# EAGLE design LightController (EAGLE 6.5.0)
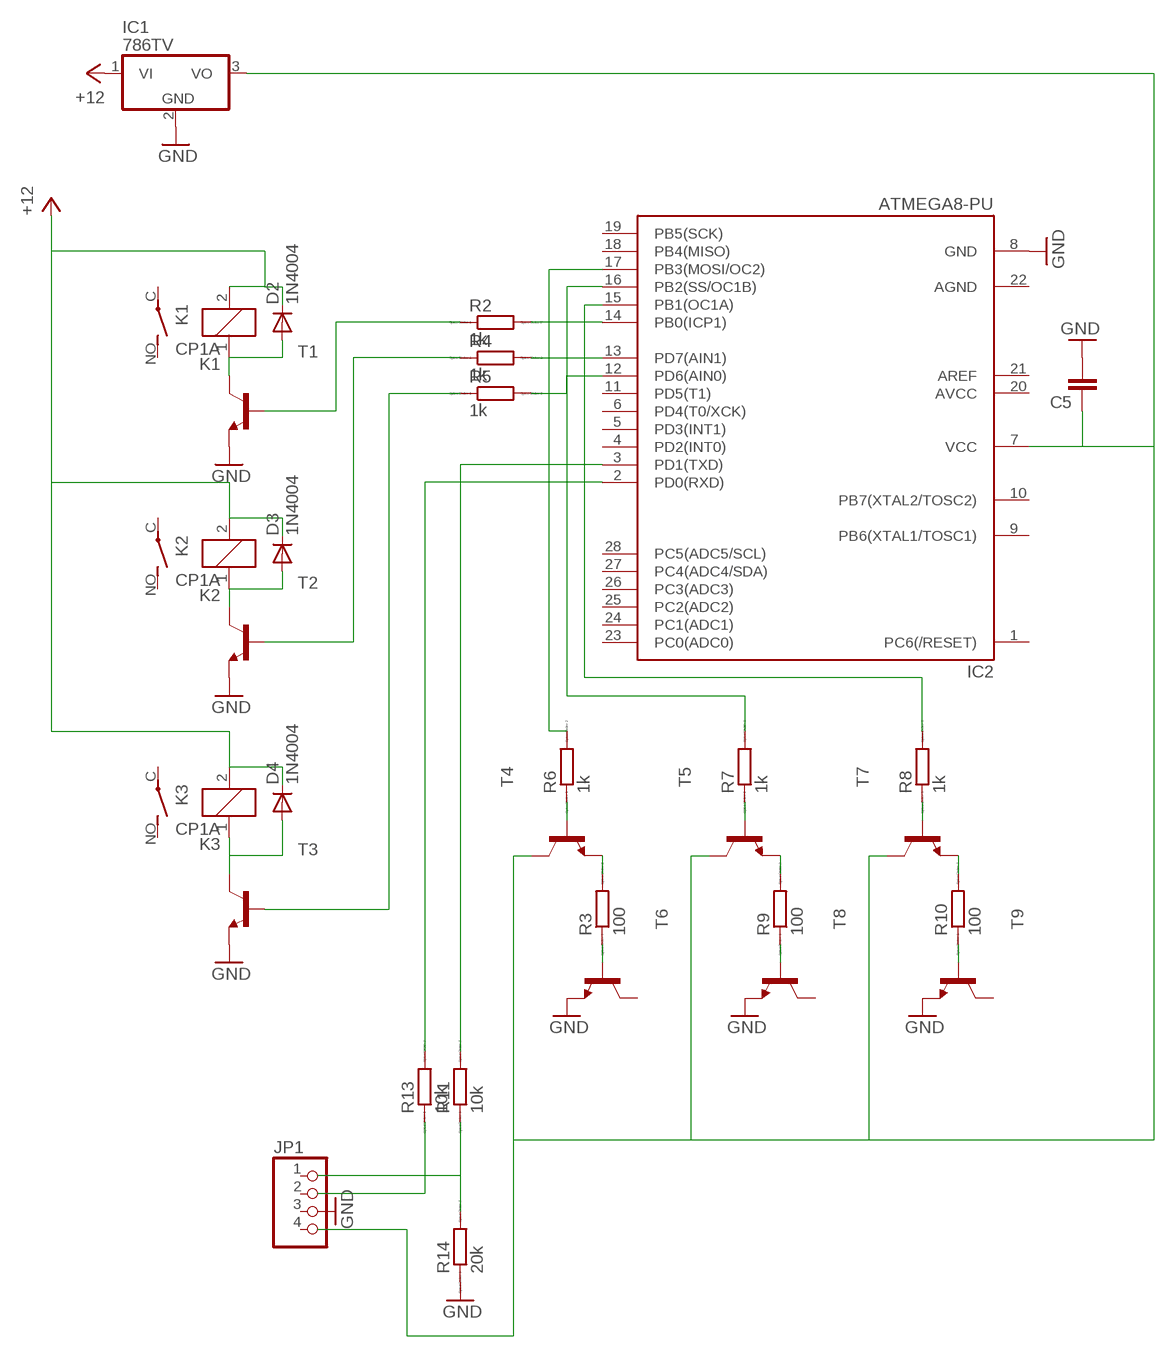
[diagram p0: schematic, sheet 1]

## Parts
C5  C2,5-3  [C2.5-3]
D2  1N4004  [DO41-10]
D3  1N4004  [DO41-10]
D4  1N4004  [DO41-10]
IC1  786TV  [TO220V]
IC2  ATMEGA8-PU  [DIL28-3]
JP1  PINHD-1X4  [1X04]
K1  CP1A  [CP1A]
K2  CP1A  [CP1A]
K3  CP1A  [CP1A]
R2  1k  R0204/7  [0204/7]
R3  100  R0204/7  [0204/7]
R4  1k  R0204/7  [0204/7]
R5  1k  R0204/7  [0204/7]
R6  1k  R0204/7  [0204/7]
R7  1k  R0204/7  [0204/7]
R8  1k  R0204/7  [0204/7]
R9  100  R0204/7  [0204/7]
R10  100  R0204/7  [0204/7]
R11  10k  R0204/7  [0204/7]
R13  10k  R0204/7  [0204/7]
R14  20k  R0204/7  [0204/7]
T1  -NPN-TO92-EBC  [TO92-EBC]
T2  -NPN-TO92-EBC  [TO92-EBC]
T3  -NPN-TO92-EBC  [TO92-EBC]
T4  -NPN-TO92-EBC  [TO92-EBC]
T5  -NPN-TO92-EBC  [TO92-EBC]
T6  BF420-NPN-TO92-BCE  [TO92-BCE]
T7  -NPN-TO92-EBC  [TO92-EBC]
T8  BF420-NPN-TO92-BCE  [TO92-BCE]
T9  BF420-NPN-TO92-BCE  [TO92-BCE]

## Nets
GND: C5.2 IC1.2(GND) IC2.8(GND) R14.1 T1.E T2.E T3.E T6.E T8.E T9.E
N$1: IC2.15(PB1(OC1A)) R8.2
N$2: IC2.16(PB2(SS/OC1B)) R7.2
N$3: R3.2 T4.E
N$4: D2.A K1.1 T1.C
N$5: IC2.14(PB0(ICP1)) R2.2
N$6: R2.1 T1.B
N$7: R4.1 T2.B
N$8: D4.A K3.1 T3.C
N$9: D3.A K2.1 T2.C
N$10: IC2.13(PD7(AIN1)) R4.2
N$11: R5.1 T3.B
N$12: IC2.12(PD6(AIN0)) R5.2
N$13: IC2.17(PB3(MOSI/OC2)) R6.2
N$14: R3.1 T6.B
N$15: R9.2 T5.E
N$16: R9.1 T8.B
N$17: R10.2 T7.E
N$18: R10.1 T9.B
N$20: R6.1 T4.B
N$21: R7.1 T5.B
N$22: R8.1 T7.B
N$25: IC2.2(PD0(RXD)) R13.2
N$26: R11.1 R14.2
N$27: IC2.3(PD1(TXD)) R11.2
N$28: R13.1
N$29: C5.1 IC1.3(VO) IC2.7(VCC) T4.C T5.C T7.C
VCC: D2.C D3.C D4.C IC1.1(VI) K1.2 K2.2 K3.2 ; supply symbol labelled +12
Unconnected: IC2.1(PC6(/RESET)) IC2.4(PD2(INT0)) IC2.5(PD3(INT1)) IC2.6(PD4(T0/XCK)) IC2.9(PB6(XTAL1/TOSC1)) IC2.10(PB7(XTAL2/TOSC2)) IC2.11(PD5(T1)) IC2.18(PB4(MISO)) IC2.19(PB5(SCK)) IC2.20(AVCC) IC2.21(AREF) IC2.23(PC0(ADC0)) IC2.24(PC1(ADC1)) IC2.25(PC2(ADC2)) IC2.26(PC3(ADC3)) IC2.27(PC4(ADC4/SDA)) IC2.28(PC5(ADC5/SCL)) JP1.1 JP1.2 JP1.3 JP1.4 K1.C(2:P) K1.NO(2:S) K2.C(2:P) K2.NO(2:S) K3.C(2:P) K3.NO(2:S) T6.C T8.C T9.C

## Power pins joined to a net without a drawn wire
AGND: IC2.22(AGND)

## Library data of the parts
C5 = capacitor-wima:C: CAPACITOR naming: grid - package width
D2-D4 = diode:1N4004: DIODE general purpose rectifier, 1 A
IC1 = linear:78*: Positive VOLTAGE REGULATOR Source: http://cache.national.com/ds/LM/LM78L05.pdf http://www.fairchildsemi.com/ds/LM/LM7805.pdf
IC2 = atmega8:ATMEGA8-PU
JP1 = pinhead:PINHD-1X4: PIN HEADER
K1-K3 = relay:CP1A: ULTRA-MINIATURE LOW PROFILE AUTOMOTIVE RELAY NAiS Source: http://www.mew-europe.com/.. en_ds_61207_0000.pdf; MF: AROMAT/ MATSUSHITA; MPN: CP1A-12V; OC_FARNELL: 1629083; OC_NEWARK: 10C5509
R2-R11 R13 R14 = eagle-ltspice:R: RESISTOR, European symbol; SPICEMODEL: NONE; SPICEPREFIX: R
T1-T9 = transistor:*-NPN-: NPN Transistror BF959 corrected 2008.03.06

## Board
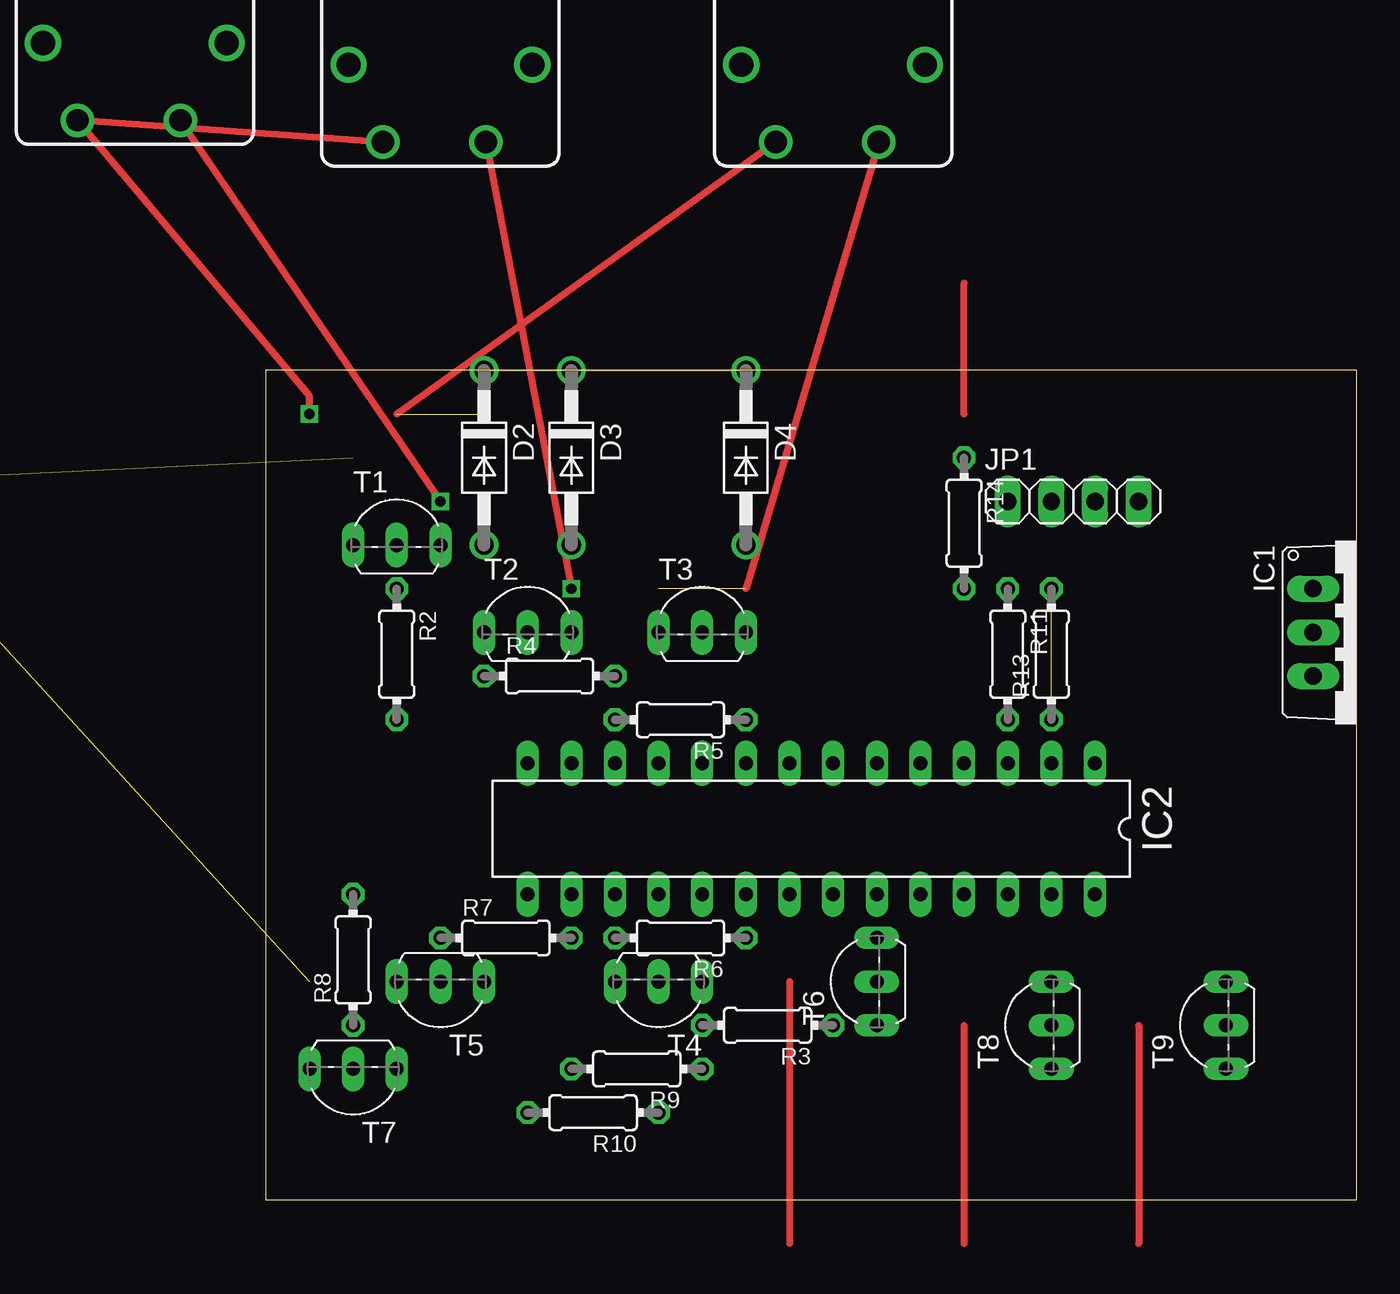
[diagram p1: board, top side]
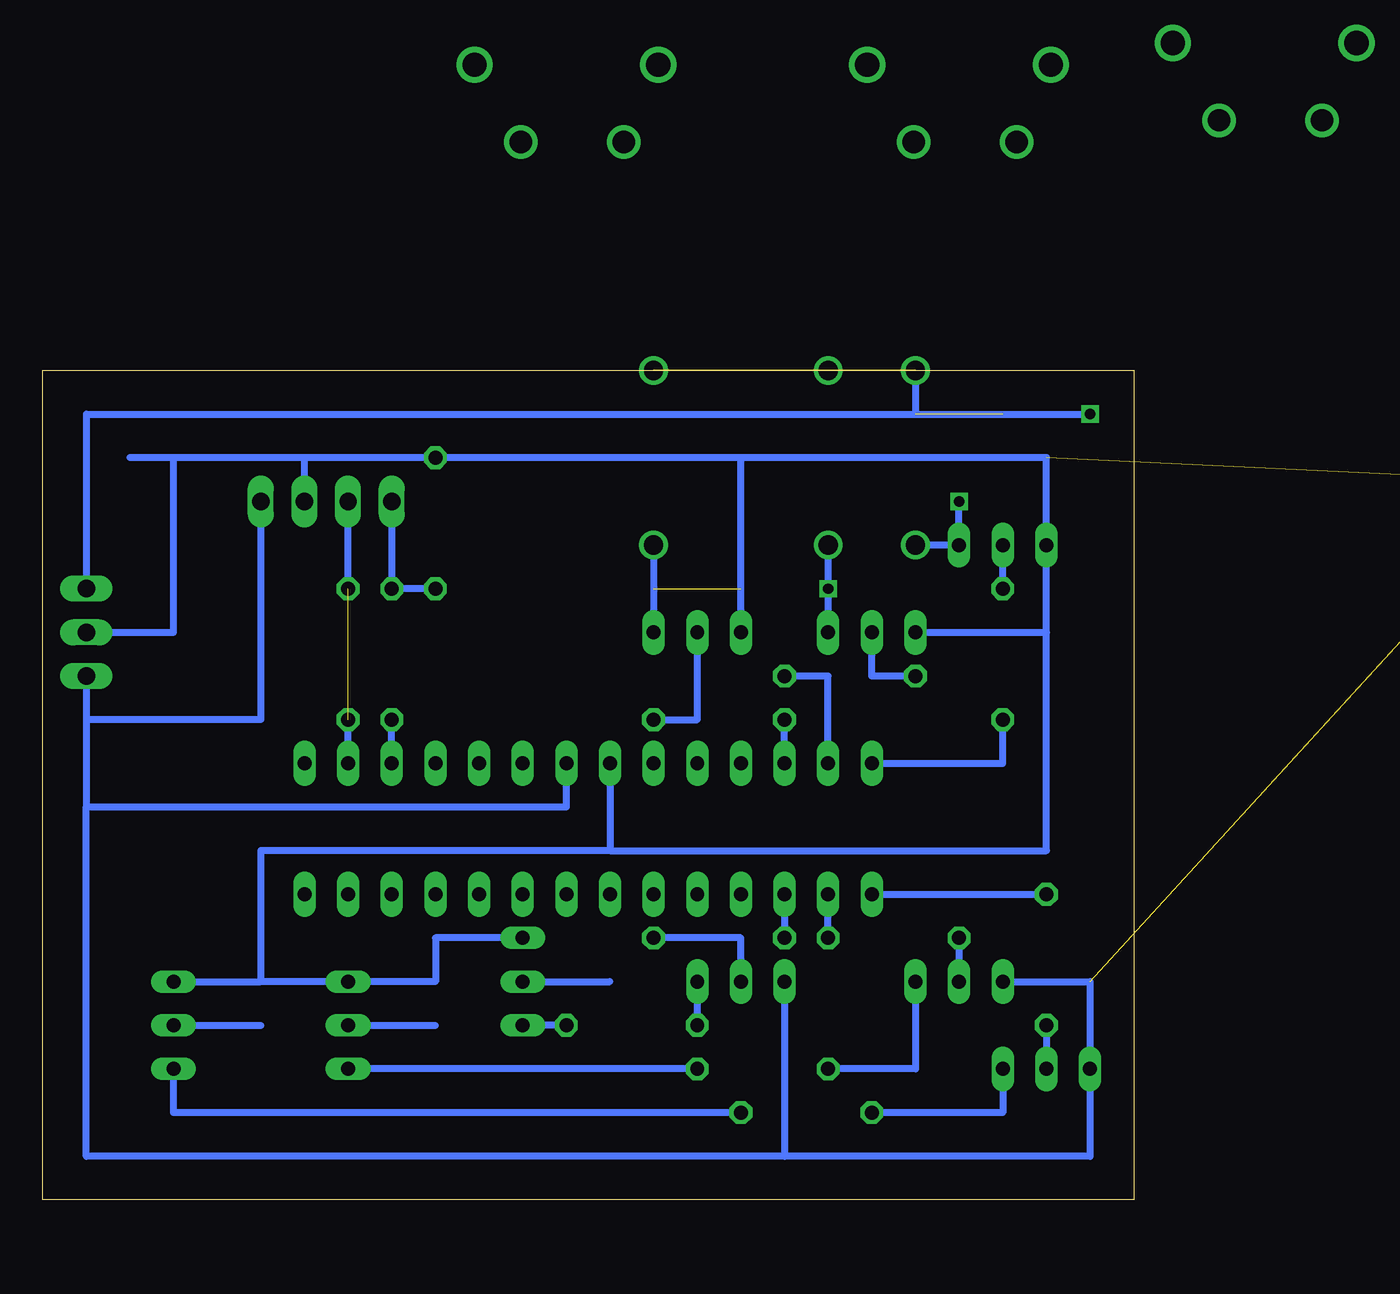
[diagram p2: board, bottom side, seen from below]

Size 63.48 x 48.26 mm. Coordinates in mm from the lower left corner, seen from the top.
Outline: 0,0 63.48,0 63.48,48.26 0,48.26 0,0
Copper layers (1*16): Top 0.035mm / dielectric 1.5mm / Bottom 0.035mm
Design rules "default": minimum track width 10mil, minimum drill 24mil, track to track 8mil, track to pad 8mil, pad to pad 8mil, via to via 8mil, smd to smd 8mil, copper to edge 40mil, drill to drill 8mil, minimum pad ring 10mil, minimum via ring 8mil, stop-mask expansion 4mil, vias tented up to drill 0mil, thermal gap 10mil

### Footprints (pad centres in the part's own frame; a part is rotated, then mirrored left to right if it is on the bottom)
C2.5-3 = drill 0.813 pad 1.6 octagon: 1 -1.27,0; 2 1.27,0
DO41-10 = drill 1.118: A 5.08,0; C -5.08,0
TO220V = drill 1.016 long: 1 -2.54,-2.54; 2 0,-2.54; 3 2.54,-2.54
DIL28-3 = drill 0.813 long: 1 -16.51,-3.81; 2 -13.97,-3.81; 3 -11.43,-3.81; 4 -8.89,-3.81; 5 -6.35,-3.81; 6 -3.81,-3.81; 7 -1.27,-3.81; 8 1.27,-3.81; 9 3.81,-3.81; 10 6.35,-3.81; 11 8.89,-3.81; 12 11.43,-3.81; 13 13.97,-3.81; 14 16.51,-3.81; 15 16.51,3.81; 16 13.97,3.81; 17 11.43,3.81; 18 8.89,3.81; 19 6.35,3.81; 20 3.81,3.81; 21 1.27,3.81; 22 -1.27,3.81; 23 -3.81,3.81; 24 -6.35,3.81; 25 -8.89,3.81; 26 -11.43,3.81; 27 -13.97,3.81; 28 -16.51,3.81
1X04 = drill 1.016 long: 1 -3.81,0; 2 -1.27,0; 3 1.27,0; 4 3.81,0
CP1A = drill 1.3: 1 2.65,-4.5; 2 -3.35,-4.5 | drill 1.4: C 5.35,0; NO -5.35,0
0204/7 = drill 0.813 octagon: 1 -3.81,0; 2 3.81,0
TO92-EBC = drill 0.813 long: B 0,-1.27; C 2.54,-1.27; E -2.54,-1.27
TO92-BCE = drill 0.813 long: B -2.54,0; C 0,0; E 2.54,0

### Placement (x,y rotation side)
C5  -22.86,41.91 0 top  (outside the outline)
D2  12.7,43.18 270 top
D3  17.78,43.18 270 top
D4  27.94,43.18 270 top
IC1  63.5,33.02 270 top
IC2  31.75,21.59 180 top
JP1  46.99,40.64 0 top
K1  -7.62,67.31 0 top  (outside the outline)
K2  10.16,66.04 0 top  (outside the outline)
K3  33.02,66.04 0 top  (outside the outline)
R2  7.62,31.75 270 top
R3  29.21,10.16 180 top
R4  16.51,30.48 0 top
R5  24.13,27.94 180 top
R6  24.13,15.24 180 top
R7  13.97,15.24 0 top
R8  5.08,13.97 90 top
R9  21.59,7.62 180 top
R10  19.05,5.08 180 top
R11  43.18,31.75 270 top
R13  45.72,31.75 90 top
R14  40.64,39.37 270 top
T1  7.62,39.37 0 top
T2  15.24,34.29 0 top
T3  25.4,34.29 0 top
T4  22.86,11.43 180 top
T5  10.16,11.43 180 top
T6  35.56,12.7 90 top
T7  5.08,6.35 180 top
T8  45.72,10.16 90 top
T9  55.88,10.16 90 top

### Tracks (layer width: path | path; a pad name or v marks a point on that pad's centre or on a via)
GND  (1 unrouted)
  Bottom 0.406: IC2.8 30.48,20.32 | 30.48,20.32 5.08,20.32 5.08,33.02 | 5.08,33.02 T1.E 5.08,43.18 22.86,43.18 | 22.86,43.18 R14.1 48.26,43.18 | 48.26,43.18 55.88,43.18 | 55.88,43.18 58.42,43.18 | IC1.2 55.88,33.02 55.88,43.18 | 48.26,40.64 48.26,43.18 | T2.E 5.08,33.02 | T3.E 22.86,43.18 | 30.48,20.32 50.8,20.32 50.8,12.7 | T6.E 40.64,15.24 40.64,12.7 T8.E 50.8,12.7 | T9.E 50.8,12.7
N$1
  Bottom 0.406: IC2.15 R8.2
N$2
  Bottom 0.406: R7.2 IC2.16
N$3
  Bottom 0.406: R3.2 T4.E
N$4  (via drill 0.6)
  Top 0.406: v10.16,40.64 K1.1
  Bottom 0.406: D2.A T1.C v10.16,40.64
N$5
  Bottom 0.406: IC2.14 7.62,25.4 R2.2
N$6
  Bottom 0.406: R2.1 T1.B
N$7
  Bottom 0.406: R4.1 15.24,30.48 T2.B
N$8  (1 unrouted)
  Top 0.406: K3.1 27.94,35.56
  Bottom 0.406: D4.A T3.C
N$9  (via drill 0.6)
  Top 0.406: K2.1 v17.78,35.56
  Bottom 0.406: T2.C v17.78,35.56 D3.A
N$10
  Bottom 0.406: IC2.13 17.78,30.48 R4.2
N$11
  Bottom 0.406: R5.1 25.4,27.94 T3.B
N$12
  Bottom 0.406: IC2.12 R5.2
N$13
  Bottom 0.406: IC2.17 R6.2
N$14
  Bottom 0.406: R3.1 T6.B
N$15
  Bottom 0.406: T5.E 12.7,7.62 R9.2
N$16
  Bottom 0.406: R9.1 T8.B
N$17
  Bottom 0.406: T7.E 7.62,5.08 R10.2
N$18
  Bottom 0.406: R10.1 55.88,5.08 T9.B
N$19
  Bottom 0.406: 35.56,12.7 30.48,12.7
N$20
  Bottom 0.406: T4.B 22.86,15.24 R6.1
N$21
  Bottom 0.406: R7.1 T5.B
N$22
  Bottom 0.406: R8.1 T7.B
N$23
  Bottom 0.406: 45.72,10.16 40.64,10.16
N$24
  Bottom 0.406: 55.88,10.16 50.8,10.16
N$25  (1 unrouted)
  Bottom 0.406: R13.2 45.72,40.64 | IC2.2 45.72,27.94
N$26
  Bottom 0.406: R14.2 R11.1 43.18,40.64
N$27
  Bottom 0.406: IC2.3 R11.2
N$29  (1 unrouted)
  Bottom 0.406: 50.8,40.64 50.8,27.94 60.96,27.94 | IC1.3 60.96,27.94 | 60.96,27.94 60.96,22.86 | 60.96,22.86 33.02,22.86 IC2.7 | 20.32,2.54 2.54,2.54 T7.C 2.54,12.7 T5.C | 20.32,2.54 60.96,2.54 60.96,22.86 | T4.C 20.32,2.54
N$30
  Top 0.406: 30.48,12.7 30.48,-2.54
N$31
  Top 0.406: 40.64,10.16 40.64,-2.54
N$32
  Top 0.406: 50.8,10.16 50.8,-2.54
N$33
  Top 0.406: 40.64,45.72 40.64,53.34
VCC  (via drill 0.6)  (3 unrouted)
  Top 0.406: v2.54,45.72 2.54,46.76 K1.2 K2.2 | K3.2 7.62,45.72
  Bottom 0.406: IC1.1 60.96,45.72 12.7,45.72 | 12.7,45.72 v2.54,45.72 | D2.C 12.7,45.72